# Altium project COMRAD_0v1.PrjPCB (part 5 of 5)

## Sheet DDR3_TOP_LEVEL.SchDoc
size A3; DocumentNumber: 3; SheetNumber: 3; SheetTotal: 47
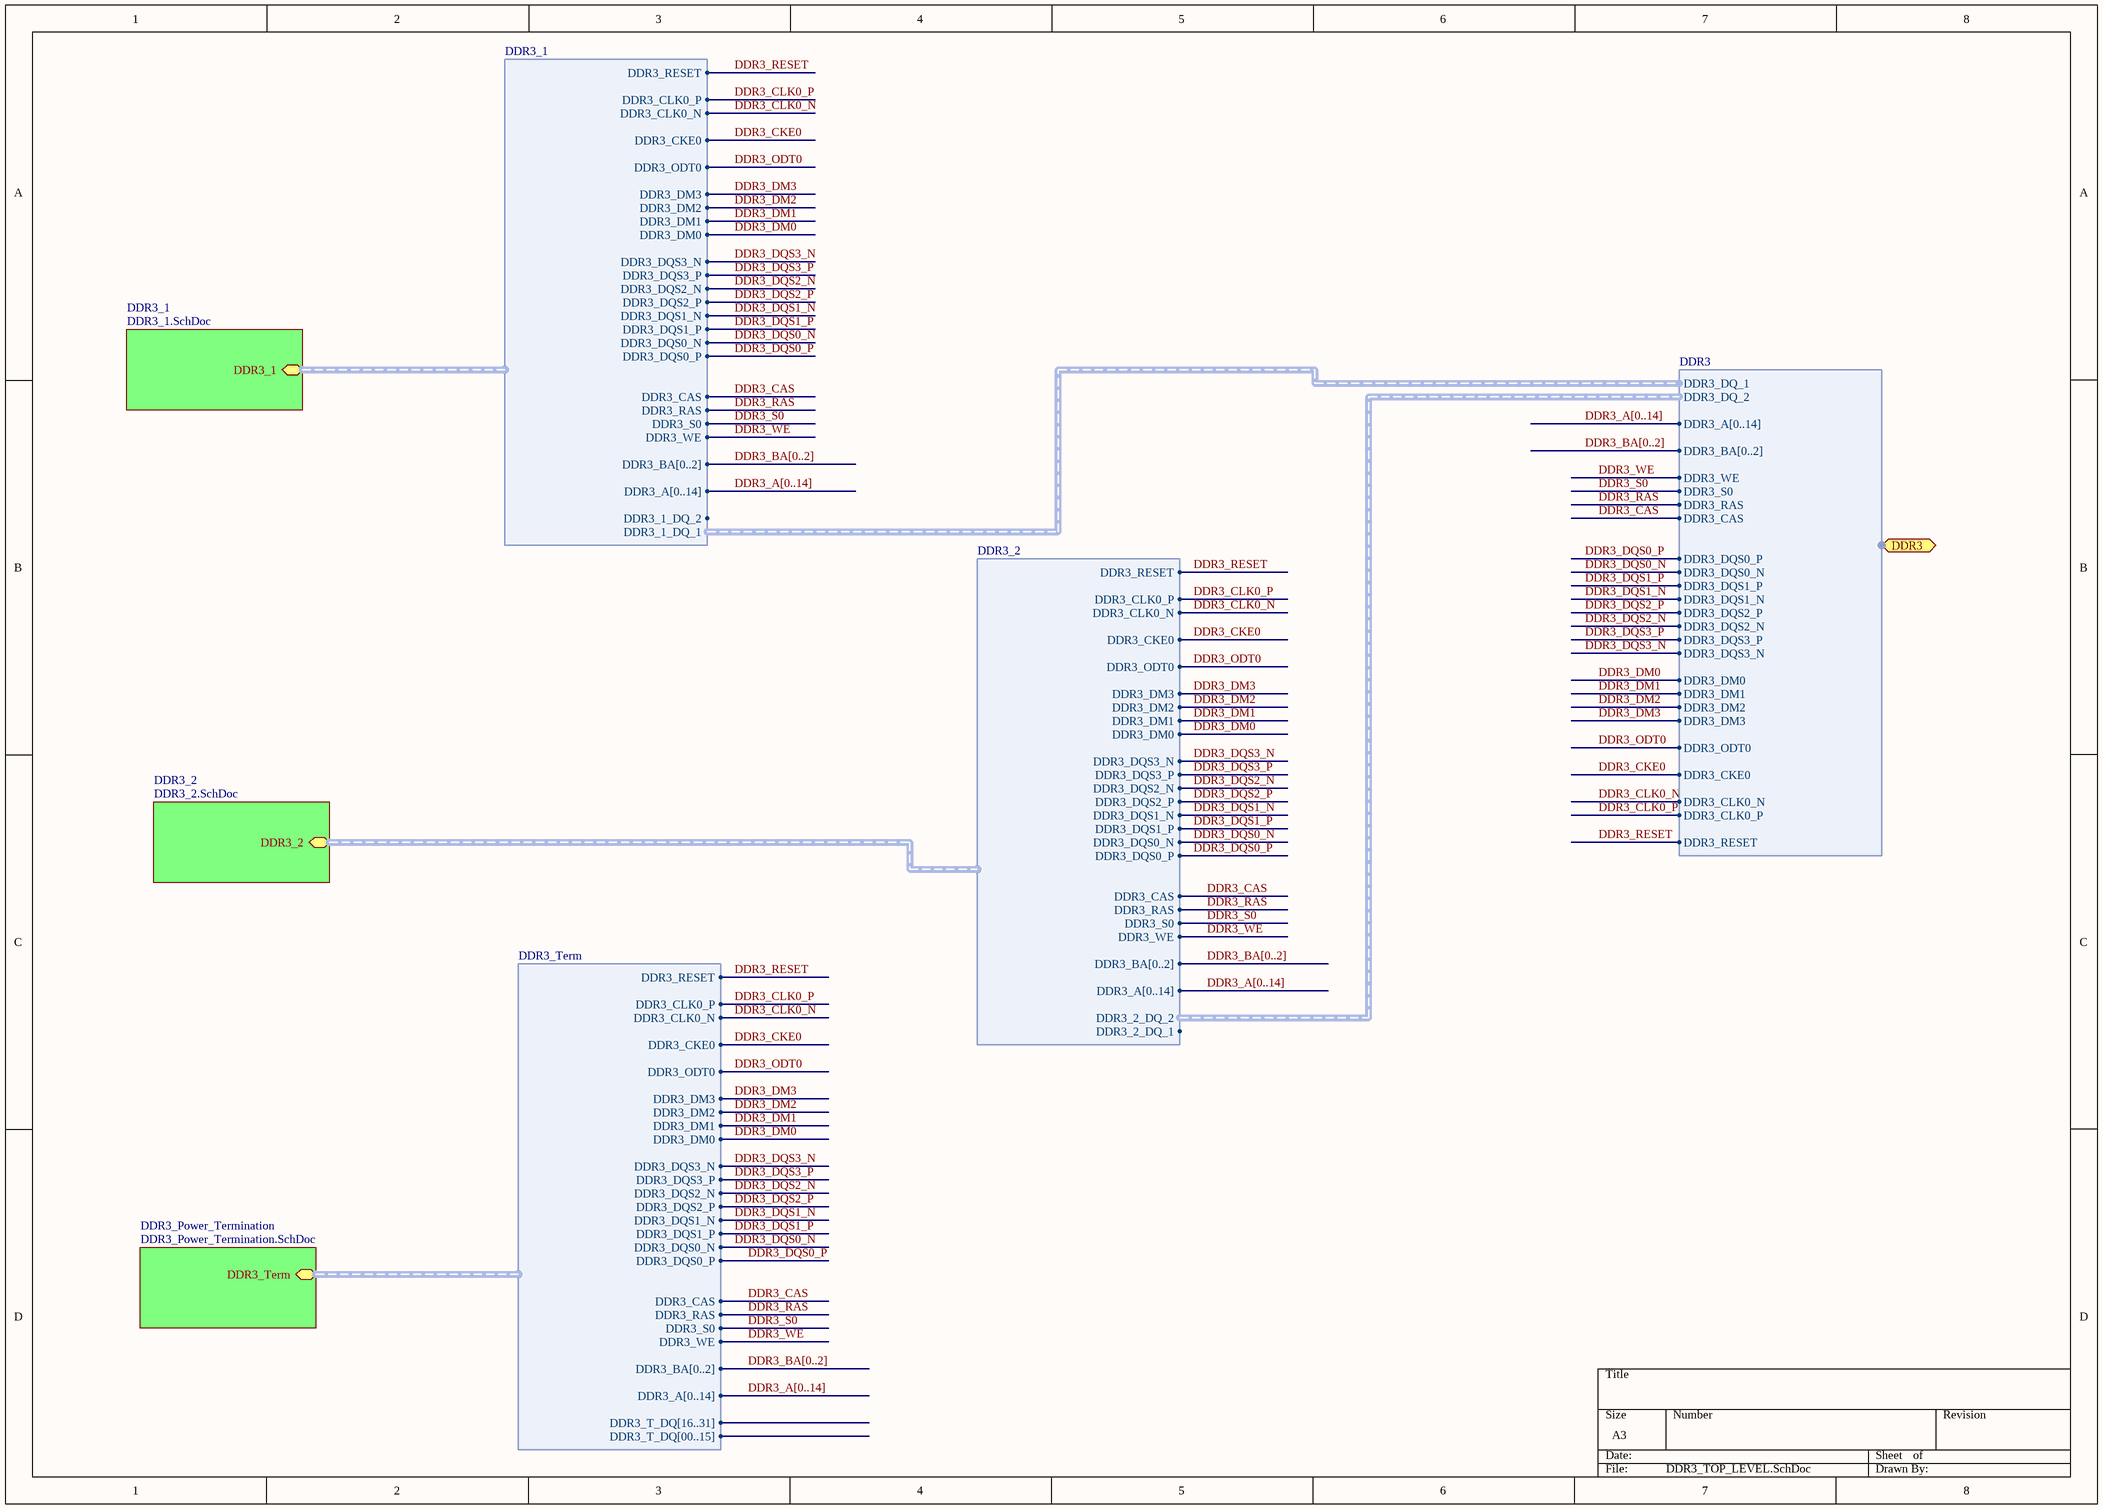
[diagram p42: DDR3_TOP_LEVEL.SchDoc]

### Sub-sheets
DDR3_1 = DDR3_1.SchDoc: DDR3_1 (harness DDR3_1)
DDR3_2 = DDR3_2.SchDoc: DDR3_2 (harness DDR3_2)
DDR3_Power_Termination = DDR3_Power_Termination.SchDoc: DDR3_Term (harness DDR3_Term)

### Ports
DDR3 (harness DDR3)

### Harnesses
DDR3: DDR3_DQ_1, DDR3_DQ_2, DDR3_A[0..14], DDR3_BA[0..2], DDR3_WE, DDR3_S0, DDR3_RAS, DDR3_CAS, DDR3_DQS0_P, DDR3_DQS0_N, DDR3_DQS1_P, DDR3_DQS1_N, DDR3_DQS2_P, DDR3_DQS2_N, DDR3_DQS3_P, DDR3_DQS3_N, DDR3_DM0, DDR3_DM1, DDR3_DM2, DDR3_DM3, DDR3_ODT0, DDR3_CKE0, DDR3_CLK0_N, DDR3_CLK0_P, DDR3_RESET
DDR3_1: DDR3_1_DQ_1, DDR3_1_DQ_2, DDR3_A[0..14], DDR3_BA[0..2], DDR3_WE, DDR3_S0, DDR3_RAS, DDR3_CAS, DDR3_DQS0_P, DDR3_DQS0_N, DDR3_DQS1_P, DDR3_DQS1_N, DDR3_DQS2_P, DDR3_DQS2_N, DDR3_DQS3_P, DDR3_DQS3_N, DDR3_DM0, DDR3_DM1, DDR3_DM2, DDR3_DM3, DDR3_ODT0, DDR3_CKE0, DDR3_CLK0_N, DDR3_CLK0_P, DDR3_RESET
DDR3_2: DDR3_2_DQ_1, DDR3_2_DQ_2, DDR3_A[0..14], DDR3_BA[0..2], DDR3_WE, DDR3_S0, DDR3_RAS, DDR3_CAS, DDR3_DQS0_P, DDR3_DQS0_N, DDR3_DQS1_P, DDR3_DQS1_N, DDR3_DQS2_P, DDR3_DQS2_N, DDR3_DQS3_P, DDR3_DQS3_N, DDR3_DM0, DDR3_DM1, DDR3_DM2, DDR3_DM3, DDR3_ODT0, DDR3_CKE0, DDR3_CLK0_N, DDR3_CLK0_P, DDR3_RESET
DDR3_Term: DDR3_T_DQ[00..15], DDR3_T_DQ[16..31], DDR3_A[0..14], DDR3_BA[0..2], DDR3_WE, DDR3_S0, DDR3_RAS, DDR3_CAS, DDR3_DQS0_P, DDR3_DQS0_N, DDR3_DQS1_P, DDR3_DQS1_N, DDR3_DQS2_P, DDR3_DQS2_N, DDR3_DQS3_P, DDR3_DQS3_N, DDR3_DM0, DDR3_DM1, DDR3_DM2, DDR3_DM3, DDR3_ODT0, DDR3_CKE0, DDR3_CLK0_N, DDR3_CLK0_P, DDR3_RESET

### Nets
DDR3_CAS: port DDR3.DDR3_CAS, sheet DDR3_1/DDR3_1.DDR3_CAS, sheet DDR3_2/DDR3_2.DDR3_CAS, sheet DDR3_Power_Termination/DDR3_Term.DDR3_CAS
DDR3_CKE0: port DDR3.DDR3_CKE0, sheet DDR3_1/DDR3_1.DDR3_CKE0, sheet DDR3_2/DDR3_2.DDR3_CKE0, sheet DDR3_Power_Termination/DDR3_Term.DDR3_CKE0
DDR3_CLK0_N: port DDR3.DDR3_CLK0_N, sheet DDR3_1/DDR3_1.DDR3_CLK0_N, sheet DDR3_2/DDR3_2.DDR3_CLK0_N, sheet DDR3_Power_Termination/DDR3_Term.DDR3_CLK0_N
DDR3_CLK0_P: port DDR3.DDR3_CLK0_P, sheet DDR3_1/DDR3_1.DDR3_CLK0_P, sheet DDR3_2/DDR3_2.DDR3_CLK0_P, sheet DDR3_Power_Termination/DDR3_Term.DDR3_CLK0_P
DDR3_DM0: port DDR3.DDR3_DM0, sheet DDR3_1/DDR3_1.DDR3_DM0, sheet DDR3_2/DDR3_2.DDR3_DM0, sheet DDR3_Power_Termination/DDR3_Term.DDR3_DM0
DDR3_DM1: port DDR3.DDR3_DM1, sheet DDR3_1/DDR3_1.DDR3_DM1, sheet DDR3_2/DDR3_2.DDR3_DM1, sheet DDR3_Power_Termination/DDR3_Term.DDR3_DM1
DDR3_DM2: port DDR3.DDR3_DM2, sheet DDR3_1/DDR3_1.DDR3_DM2, sheet DDR3_2/DDR3_2.DDR3_DM2, sheet DDR3_Power_Termination/DDR3_Term.DDR3_DM2
DDR3_DM3: port DDR3.DDR3_DM3, sheet DDR3_1/DDR3_1.DDR3_DM3, sheet DDR3_2/DDR3_2.DDR3_DM3, sheet DDR3_Power_Termination/DDR3_Term.DDR3_DM3
DDR3_DQS0_N: port DDR3.DDR3_DQS0_N, sheet DDR3_1/DDR3_1.DDR3_DQS0_N, sheet DDR3_2/DDR3_2.DDR3_DQS0_N, sheet DDR3_Power_Termination/DDR3_Term.DDR3_DQS0_N
DDR3_DQS0_P: port DDR3.DDR3_DQS0_P, sheet DDR3_1/DDR3_1.DDR3_DQS0_P, sheet DDR3_2/DDR3_2.DDR3_DQS0_P, sheet DDR3_Power_Termination/DDR3_Term.DDR3_DQS0_P
DDR3_DQS1_N: port DDR3.DDR3_DQS1_N, sheet DDR3_1/DDR3_1.DDR3_DQS1_N, sheet DDR3_2/DDR3_2.DDR3_DQS1_N, sheet DDR3_Power_Termination/DDR3_Term.DDR3_DQS1_N
DDR3_DQS1_P: port DDR3.DDR3_DQS1_P, sheet DDR3_1/DDR3_1.DDR3_DQS1_P, sheet DDR3_2/DDR3_2.DDR3_DQS1_P, sheet DDR3_Power_Termination/DDR3_Term.DDR3_DQS1_P
DDR3_DQS2_N: port DDR3.DDR3_DQS2_N, sheet DDR3_1/DDR3_1.DDR3_DQS2_N, sheet DDR3_2/DDR3_2.DDR3_DQS2_N, sheet DDR3_Power_Termination/DDR3_Term.DDR3_DQS2_N
DDR3_DQS2_P: port DDR3.DDR3_DQS2_P, sheet DDR3_1/DDR3_1.DDR3_DQS2_P, sheet DDR3_2/DDR3_2.DDR3_DQS2_P, sheet DDR3_Power_Termination/DDR3_Term.DDR3_DQS2_P
DDR3_DQS3_N: port DDR3.DDR3_DQS3_N, sheet DDR3_1/DDR3_1.DDR3_DQS3_N, sheet DDR3_2/DDR3_2.DDR3_DQS3_N, sheet DDR3_Power_Termination/DDR3_Term.DDR3_DQS3_N
DDR3_DQS3_P: port DDR3.DDR3_DQS3_P, sheet DDR3_1/DDR3_1.DDR3_DQS3_P, sheet DDR3_2/DDR3_2.DDR3_DQS3_P, sheet DDR3_Power_Termination/DDR3_Term.DDR3_DQS3_P
DDR3_ODT0: port DDR3.DDR3_ODT0, sheet DDR3_1/DDR3_1.DDR3_ODT0, sheet DDR3_2/DDR3_2.DDR3_ODT0, sheet DDR3_Power_Termination/DDR3_Term.DDR3_ODT0
DDR3_RAS: port DDR3.DDR3_RAS, sheet DDR3_1/DDR3_1.DDR3_RAS, sheet DDR3_2/DDR3_2.DDR3_RAS, sheet DDR3_Power_Termination/DDR3_Term.DDR3_RAS
DDR3_RESET: port DDR3.DDR3_RESET, sheet DDR3_1/DDR3_1.DDR3_RESET, sheet DDR3_2/DDR3_2.DDR3_RESET, sheet DDR3_Power_Termination/DDR3_Term.DDR3_RESET
DDR3_S0: port DDR3.DDR3_S0, sheet DDR3_1/DDR3_1.DDR3_S0, sheet DDR3_2/DDR3_2.DDR3_S0, sheet DDR3_Power_Termination/DDR3_Term.DDR3_S0
DDR3_WE: port DDR3.DDR3_WE, sheet DDR3_1/DDR3_1.DDR3_WE, sheet DDR3_2/DDR3_2.DDR3_WE, sheet DDR3_Power_Termination/DDR3_Term.DDR3_WE

### Buses and harness runs
bus DDR3_A[0..14]
bus DDR3_BA[0..2]

## Sheet DDR3_1.SchDoc
size A4; DocumentNumber: 13; SheetNumber: 13; SheetTotal: 47
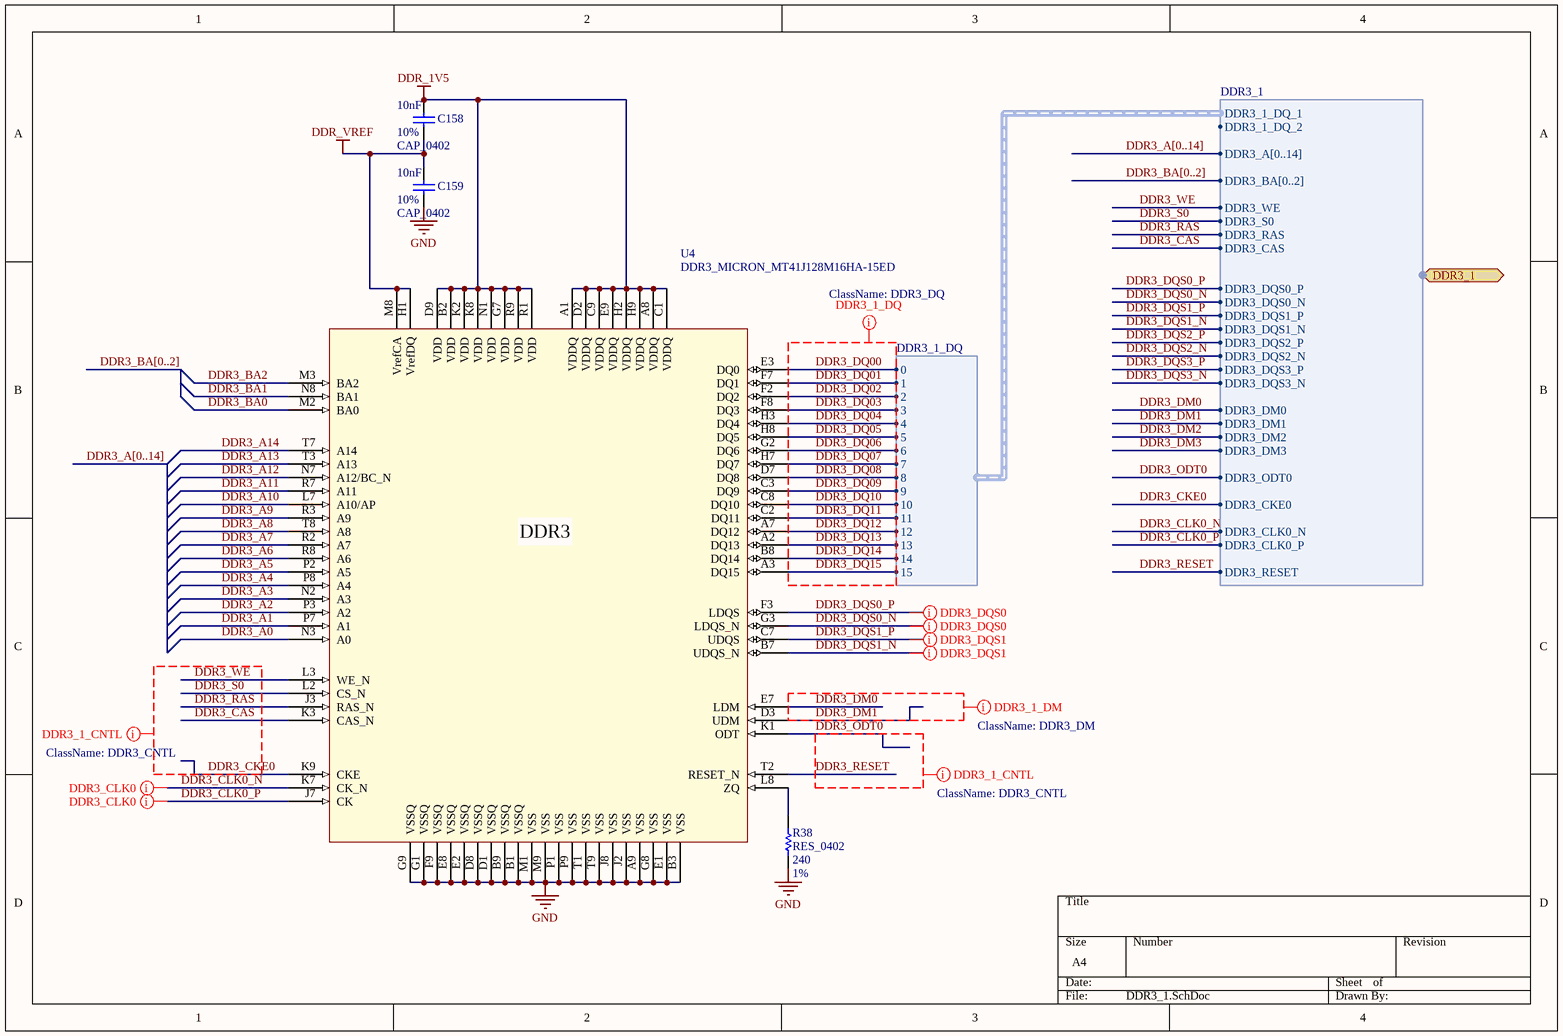
[diagram p43: DDR3_1.SchDoc]

### Parts
C158  CAP_0402  value 10nF  Tolerance: 10%  [CAPC0402(1005)60_N]
C159  CAP_0402  value 10nF  Tolerance: 10%  [CAPC0402(1005)60_N]
R38  RES_0402  value 240  Tolerance: 1%  [RESC0402(1005)_N]
U4  DDR3_MICRON_MT41J128M16HA-15ED  [DDR3_MICRON_MT41J128M16HA-15ED_FBGA96]

### Ports
DDR3_1 (harness DDR3_1)

### Harnesses
DDR3_1: DDR3_1_DQ_1, DDR3_1_DQ_2, DDR3_A[0..14], DDR3_BA[0..2], DDR3_WE, DDR3_S0, DDR3_RAS, DDR3_CAS, DDR3_DQS0_P, DDR3_DQS0_N, DDR3_DQS1_P, DDR3_DQS1_N, DDR3_DQS2_P, DDR3_DQS2_N, DDR3_DQS3_P, DDR3_DQS3_N, DDR3_DM0, DDR3_DM1, DDR3_DM2, DDR3_DM3, DDR3_ODT0, DDR3_CKE0, DDR3_CLK0_N, DDR3_CLK0_P, DDR3_RESET
DDR3_1_DQ: 0, 1, 2, 3, 4, 5, 6, 7, 8, 9, 10, 11, 12, 13, 14, 15

### Nets
DDR_1V5: C158.2 U4.A1(VDDQ) U4.A8(VDDQ) U4.B2(VDD) U4.C1(VDDQ) U4.C9(VDDQ) U4.D2(VDDQ) U4.D9(VDD) U4.E9(VDDQ) U4.G7(VDD) U4.H2(VDDQ) U4.H9(VDDQ) U4.K2(VDD) U4.K8(VDD) U4.N1(VDD) U4.R1(VDD) U4.R9(VDD)
DDR_VREF: C158.1 C159.2 U4.H1(VrefDQ) U4.M8(VrefCA)
GND: C159.1 R38.1 U4.A9(VSS) U4.B1(VSSQ) U4.B3(VSS) U4.B9(VSSQ) U4.D1(VSSQ) U4.D8(VSSQ) U4.E1(VSS) U4.E2(VSSQ) U4.E8(VSSQ) U4.F9(VSSQ) U4.G1(VSSQ) U4.G8(VSS) U4.G9(VSSQ) U4.J2(VSS) U4.J8(VSS) U4.M1(VSS) U4.M9(VSS) U4.P1(VSS) U4.P9(VSS) U4.T1(VSS) U4.T9(VSS)
DDR3_A0: U4.N3(A0)
DDR3_A1: U4.P7(A1)
DDR3_A2: U4.P3(A2)
DDR3_A3: U4.N2(A3)
DDR3_A4: U4.P8(A4)
DDR3_A5: U4.P2(A5)
DDR3_A6: U4.R8(A6)
DDR3_A7: U4.R2(A7)
DDR3_A8: U4.T8(A8)
DDR3_A9: U4.R3(A9)
DDR3_A10: U4.L7(A10/AP)
DDR3_A11: U4.R7(A11)
DDR3_A12: U4.N7(A12/BC_N)
DDR3_A13: U4.T3(A13)
DDR3_A14: U4.T7(A14)
DDR3_BA0: U4.M2(BA0)
DDR3_BA1: U4.N8(BA1)
DDR3_BA2: U4.M3(BA2)
DDR3_CAS: U4.K3(CAS_N) ; port DDR3_1.DDR3_CAS
DDR3_CKE0: U4.K9(CKE) ; port DDR3_1.DDR3_CKE0
DDR3_CLK0_N: U4.K7(CK_N) ; port DDR3_1.DDR3_CLK0_N
DDR3_CLK0_P: U4.J7(CK) ; port DDR3_1.DDR3_CLK0_P
DDR3_DM0: U4.E7(LDM) ; port DDR3_1.DDR3_DM0
DDR3_DM1: U4.D3(UDM) ; port DDR3_1.DDR3_DM1
DDR3_DQ00: U4.E3(DQ0) ; harness DDR3_1_DQ.0
DDR3_DQ01: U4.F7(DQ1) ; harness DDR3_1_DQ.1
DDR3_DQ02: U4.F2(DQ2) ; harness DDR3_1_DQ.2
DDR3_DQ03: U4.F8(DQ3) ; harness DDR3_1_DQ.3
DDR3_DQ04: U4.H3(DQ4) ; harness DDR3_1_DQ.4
DDR3_DQ05: U4.H8(DQ5) ; harness DDR3_1_DQ.5
DDR3_DQ06: U4.G2(DQ6) ; harness DDR3_1_DQ.6
DDR3_DQ07: U4.H7(DQ7) ; harness DDR3_1_DQ.7
DDR3_DQ08: U4.D7(DQ8) ; harness DDR3_1_DQ.8
DDR3_DQ09: U4.C3(DQ9) ; harness DDR3_1_DQ.9
DDR3_DQ10: U4.C8(DQ10) ; harness DDR3_1_DQ.10
DDR3_DQ11: U4.C2(DQ11) ; harness DDR3_1_DQ.11
DDR3_DQ12: U4.A7(DQ12) ; harness DDR3_1_DQ.12
DDR3_DQ13: U4.A2(DQ13) ; harness DDR3_1_DQ.13
DDR3_DQ14: U4.B8(DQ14) ; harness DDR3_1_DQ.14
DDR3_DQ15: U4.A3(DQ15) ; harness DDR3_1_DQ.15
DDR3_DQS0_N: U4.G3(LDQS_N) ; port DDR3_1.DDR3_DQS0_N
DDR3_DQS0_P: U4.F3(LDQS) ; port DDR3_1.DDR3_DQS0_P
DDR3_DQS1_N: U4.B7(UDQS_N) ; port DDR3_1.DDR3_DQS1_N
DDR3_DQS1_P: U4.C7(UDQS) ; port DDR3_1.DDR3_DQS1_P
DDR3_ODT0: U4.K1(ODT) ; port DDR3_1.DDR3_ODT0
DDR3_RAS: U4.J3(RAS_N) ; port DDR3_1.DDR3_RAS
DDR3_RESET: U4.T2(RESET_N) ; port DDR3_1.DDR3_RESET
DDR3_S0: U4.L2(CS_N) ; port DDR3_1.DDR3_S0
DDR3_WE: U4.L3(WE_N) ; port DDR3_1.DDR3_WE
NetR38_2: R38.2 U4.L8(ZQ)

### Buses and harness runs
bus DDR3_A[0..14]
bus DDR3_BA[0..2]

### Layout directives
differential pair: DDR3_CLK0_N, DDR3_CLK0_P, DDR3_DQS0_N, DDR3_DQS0_P, DDR3_DQS1_N, DDR3_DQS1_P
net class DDR3_DQ: DDR3_DQ00, DDR3_DQ01, DDR3_DQ02, DDR3_DQ03, DDR3_DQ04, DDR3_DQ05, DDR3_DQ06, DDR3_DQ07, DDR3_DQ08, DDR3_DQ09, DDR3_DQ10, DDR3_DQ11, DDR3_DQ12, DDR3_DQ13, DDR3_DQ14, DDR3_DQ15
net class DDR3_DM: DDR3_DM0, DDR3_DM1
net class DDR3_CNTL: DDR3_CAS, DDR3_CKE0, DDR3_ODT0, DDR3_RAS, DDR3_RESET, DDR3_S0, DDR3_WE

### Notes on the sheet
- (in symbol MT41J128M16HA-15E:D TR) DDR3

### Library data of the parts
C158 C159 = CAP_0402: 10000pF, ceramic, 10% 6.3V X5R, 0402; Part Number: GRM155R60J103KA01D; Manufacturer: Murata Electronics North America; Footprint Ref: CAPC0402(1005)60_N; Library Ref: CAP_0402
R38 = RES_0402: 240 ohm, 1% 1/16W, 0402; Part Number: CRCW0402240RFKED; Manufacturer: Vishay/Dale; Library Ref: RES_0402; Footprint Ref: RESC0402(1005)_N
U4 = MT41J128M16HA-15E:D TR: MT41J128M16HA-15E:D, DDR3 SDRAM 4Gb x4, x8, x16, FBGA96; Manufacturer: MICRON; Part Number: MT41J128M16HA-15E:D TR

## Sheet DDR3_2.SchDoc
size A4; DocumentNumber: 14; SheetNumber: 14; SheetTotal: 47
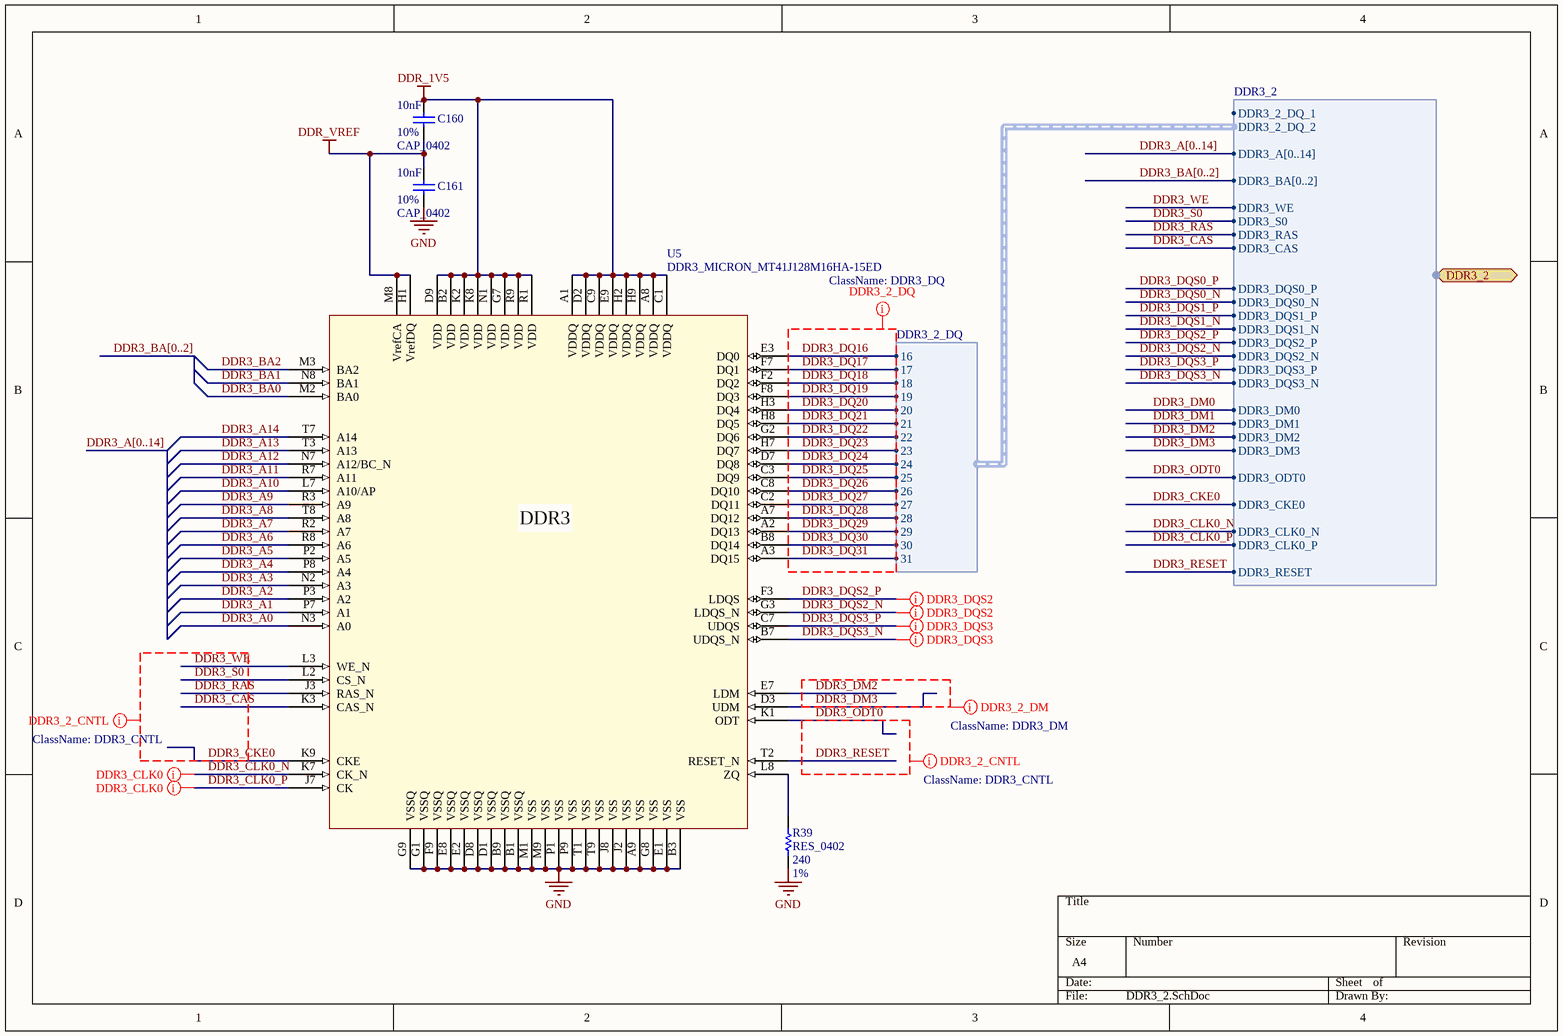
[diagram p44: DDR3_2.SchDoc]

### Parts
C160  CAP_0402  value 10nF  Tolerance: 10%  [CAPC0402(1005)60_N]
C161  CAP_0402  value 10nF  Tolerance: 10%  [CAPC0402(1005)60_N]
R39  RES_0402  value 240  Tolerance: 1%  [RESC0402(1005)_N]
U5  DDR3_MICRON_MT41J128M16HA-15ED  [DDR3_MICRON_MT41J128M16HA-15ED_FBGA96]

### Ports
DDR3_2 (harness DDR3_2)

### Harnesses
DDR3_2: DDR3_2_DQ_1, DDR3_2_DQ_2, DDR3_A[0..14], DDR3_BA[0..2], DDR3_WE, DDR3_S0, DDR3_RAS, DDR3_CAS, DDR3_DQS0_P, DDR3_DQS0_N, DDR3_DQS1_P, DDR3_DQS1_N, DDR3_DQS2_P, DDR3_DQS2_N, DDR3_DQS3_P, DDR3_DQS3_N, DDR3_DM0, DDR3_DM1, DDR3_DM2, DDR3_DM3, DDR3_ODT0, DDR3_CKE0, DDR3_CLK0_N, DDR3_CLK0_P, DDR3_RESET
DDR3_2_DQ: 16, 17, 18, 19, 20, 21, 22, 23, 24, 25, 26, 27, 28, 29, 30, 31

### Nets
DDR_1V5: C160.2 U5.A1(VDDQ) U5.A8(VDDQ) U5.B2(VDD) U5.C1(VDDQ) U5.C9(VDDQ) U5.D2(VDDQ) U5.D9(VDD) U5.E9(VDDQ) U5.G7(VDD) U5.H2(VDDQ) U5.H9(VDDQ) U5.K2(VDD) U5.K8(VDD) U5.N1(VDD) U5.R1(VDD) U5.R9(VDD)
DDR_VREF: C160.1 C161.2 U5.H1(VrefDQ) U5.M8(VrefCA)
GND: C161.1 R39.1 U5.A9(VSS) U5.B1(VSSQ) U5.B3(VSS) U5.B9(VSSQ) U5.D1(VSSQ) U5.D8(VSSQ) U5.E1(VSS) U5.E2(VSSQ) U5.E8(VSSQ) U5.F9(VSSQ) U5.G1(VSSQ) U5.G8(VSS) U5.G9(VSSQ) U5.J2(VSS) U5.J8(VSS) U5.M1(VSS) U5.M9(VSS) U5.P1(VSS) U5.P9(VSS) U5.T1(VSS) U5.T9(VSS)
DDR3_A0: U5.N3(A0)
DDR3_A1: U5.P7(A1)
DDR3_A2: U5.P3(A2)
DDR3_A3: U5.N2(A3)
DDR3_A4: U5.P8(A4)
DDR3_A5: U5.P2(A5)
DDR3_A6: U5.R8(A6)
DDR3_A7: U5.R2(A7)
DDR3_A8: U5.T8(A8)
DDR3_A9: U5.R3(A9)
DDR3_A10: U5.L7(A10/AP)
DDR3_A11: U5.R7(A11)
DDR3_A12: U5.N7(A12/BC_N)
DDR3_A13: U5.T3(A13)
DDR3_A14: U5.T7(A14)
DDR3_BA0: U5.M2(BA0)
DDR3_BA1: U5.N8(BA1)
DDR3_BA2: U5.M3(BA2)
DDR3_CAS: U5.K3(CAS_N) ; port DDR3_2.DDR3_CAS
DDR3_CKE0: U5.K9(CKE) ; port DDR3_2.DDR3_CKE0
DDR3_CLK0_N: U5.K7(CK_N) ; port DDR3_2.DDR3_CLK0_N
DDR3_CLK0_P: U5.J7(CK) ; port DDR3_2.DDR3_CLK0_P
DDR3_DM2: U5.E7(LDM) ; port DDR3_2.DDR3_DM2
DDR3_DM3: U5.D3(UDM) ; port DDR3_2.DDR3_DM3
DDR3_DQ16: U5.E3(DQ0) ; harness DDR3_2_DQ.16
DDR3_DQ17: U5.F7(DQ1) ; harness DDR3_2_DQ.17
DDR3_DQ18: U5.F2(DQ2) ; harness DDR3_2_DQ.18
DDR3_DQ19: U5.F8(DQ3) ; harness DDR3_2_DQ.19
DDR3_DQ20: U5.H3(DQ4) ; harness DDR3_2_DQ.20
DDR3_DQ21: U5.H8(DQ5) ; harness DDR3_2_DQ.21
DDR3_DQ22: U5.G2(DQ6) ; harness DDR3_2_DQ.22
DDR3_DQ23: U5.H7(DQ7) ; harness DDR3_2_DQ.23
DDR3_DQ24: U5.D7(DQ8) ; harness DDR3_2_DQ.24
DDR3_DQ25: U5.C3(DQ9) ; harness DDR3_2_DQ.25
DDR3_DQ26: U5.C8(DQ10) ; harness DDR3_2_DQ.26
DDR3_DQ27: U5.C2(DQ11) ; harness DDR3_2_DQ.27
DDR3_DQ28: U5.A7(DQ12) ; harness DDR3_2_DQ.28
DDR3_DQ29: U5.A2(DQ13) ; harness DDR3_2_DQ.29
DDR3_DQ30: U5.B8(DQ14) ; harness DDR3_2_DQ.30
DDR3_DQ31: U5.A3(DQ15) ; harness DDR3_2_DQ.31
DDR3_DQS2_N: U5.G3(LDQS_N) ; port DDR3_2.DDR3_DQS2_N
DDR3_DQS2_P: U5.F3(LDQS) ; port DDR3_2.DDR3_DQS2_P
DDR3_DQS3_N: U5.B7(UDQS_N) ; port DDR3_2.DDR3_DQS3_N
DDR3_DQS3_P: U5.C7(UDQS) ; port DDR3_2.DDR3_DQS3_P
DDR3_ODT0: U5.K1(ODT) ; port DDR3_2.DDR3_ODT0
DDR3_RAS: U5.J3(RAS_N) ; port DDR3_2.DDR3_RAS
DDR3_RESET: U5.T2(RESET_N) ; port DDR3_2.DDR3_RESET
DDR3_S0: U5.L2(CS_N) ; port DDR3_2.DDR3_S0
DDR3_WE: U5.L3(WE_N) ; port DDR3_2.DDR3_WE
NetR39_2: R39.2 U5.L8(ZQ)

### Buses and harness runs
bus DDR3_A[0..14]
bus DDR3_BA[0..2]

### Layout directives
differential pair: DDR3_CLK0_N, DDR3_CLK0_P, DDR3_DQS2_N, DDR3_DQS2_P, DDR3_DQS3_N, DDR3_DQS3_P
net class DDR3_DQ: DDR3_DQ16, DDR3_DQ17, DDR3_DQ18, DDR3_DQ19, DDR3_DQ20, DDR3_DQ21, DDR3_DQ22, DDR3_DQ23, DDR3_DQ24, DDR3_DQ25, DDR3_DQ26, DDR3_DQ27, DDR3_DQ28, DDR3_DQ29, DDR3_DQ30, DDR3_DQ31
net class DDR3_DM: DDR3_DM2, DDR3_DM3
net class DDR3_CNTL: DDR3_CAS, DDR3_CKE0, DDR3_ODT0, DDR3_RAS, DDR3_RESET, DDR3_S0, DDR3_WE

### Notes on the sheet
- (in symbol MT41J128M16HA-15E:D TR) DDR3

### Library data of the parts
C160 C161 = CAP_0402: as C158 on sheet DDR3_1; Footprint Ref: CAPC0402(1005)60_N; Library Ref: CAP_0402
R39 = RES_0402: as R38 on sheet DDR3_1; Library Ref: RES_0402; Footprint Ref: RESC0402(1005)_N
U5 = MT41J128M16HA-15E:D TR: as U4 on sheet DDR3_1; Part Number: MT41J128M16HA-15E:D TR

## Sheet DDR3_Power_Termination.SchDoc
size A3; DocumentNumber: 15; SheetNumber: 15; SheetTotal: 47
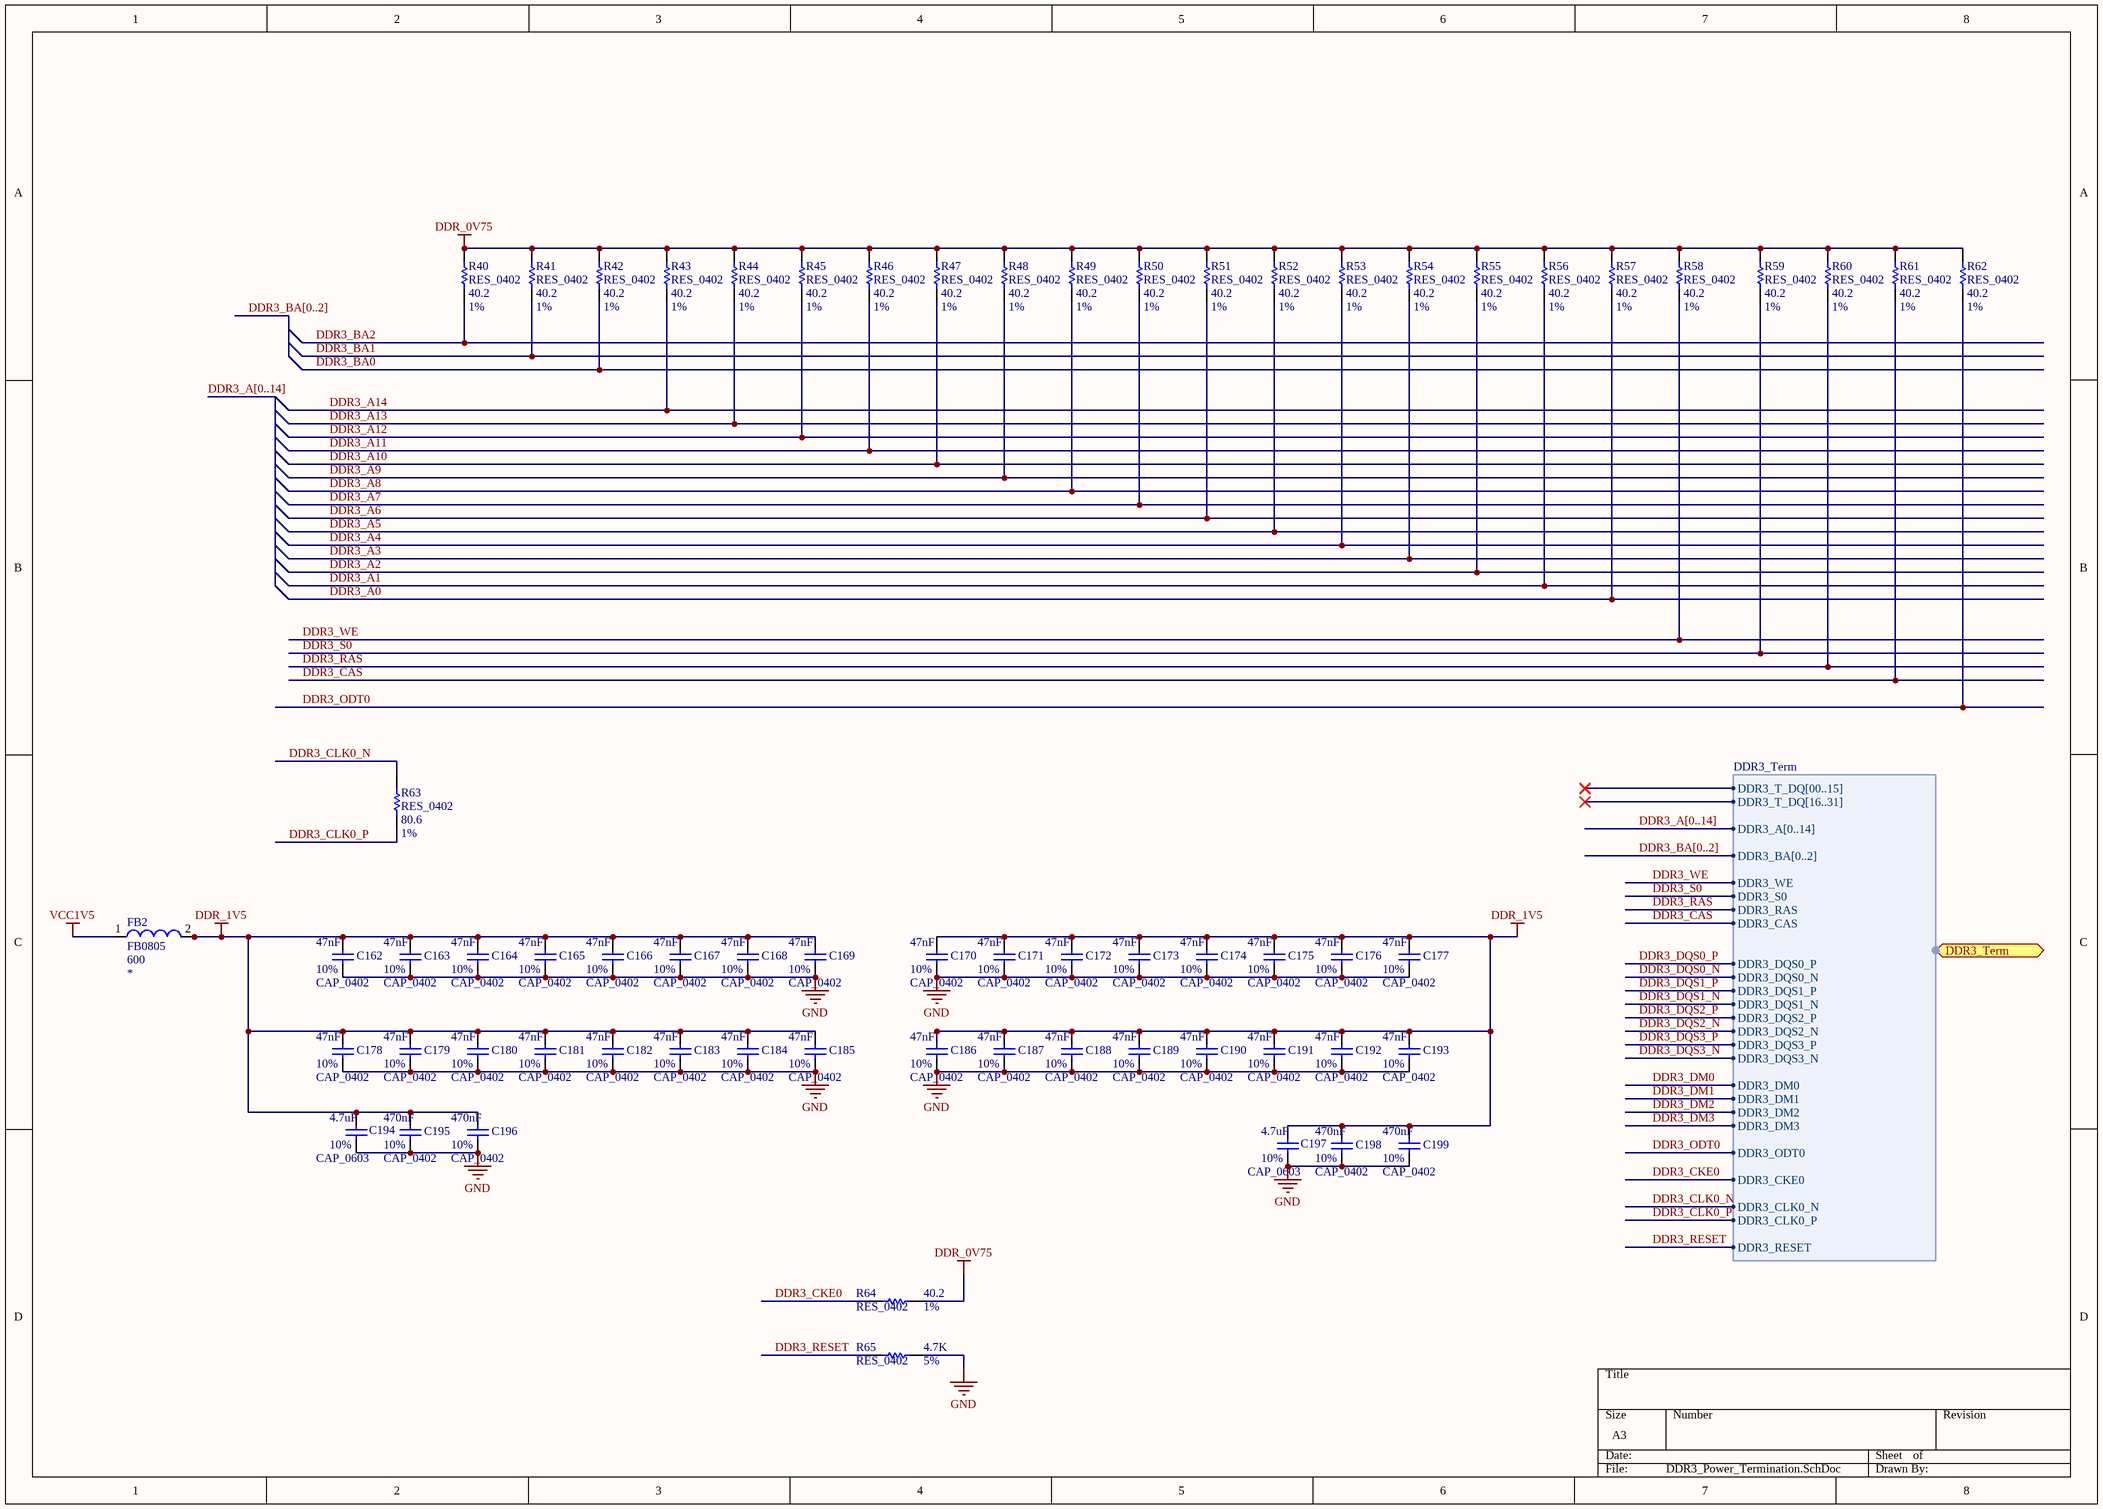
[diagram p45: DDR3_Power_Termination.SchDoc]

### Parts
C162  CAP_0402  value 47nF  Tolerance: 10%  [CAPC0402(1005)60_N]
C163  CAP_0402  value 47nF  Tolerance: 10%  [CAPC0402(1005)60_N]
C164  CAP_0402  value 47nF  Tolerance: 10%  [CAPC0402(1005)60_N]
C165  CAP_0402  value 47nF  Tolerance: 10%  [CAPC0402(1005)60_N]
C166  CAP_0402  value 47nF  Tolerance: 10%  [CAPC0402(1005)60_N]
C167  CAP_0402  value 47nF  Tolerance: 10%  [CAPC0402(1005)60_N]
C168  CAP_0402  value 47nF  Tolerance: 10%  [CAPC0402(1005)60_N]
C169  CAP_0402  value 47nF  Tolerance: 10%  [CAPC0402(1005)60_N]
C170  CAP_0402  value 47nF  Tolerance: 10%  [CAPC0402(1005)60_N]
C171  CAP_0402  value 47nF  Tolerance: 10%  [CAPC0402(1005)60_N]
C172  CAP_0402  value 47nF  Tolerance: 10%  [CAPC0402(1005)60_N]
C173  CAP_0402  value 47nF  Tolerance: 10%  [CAPC0402(1005)60_N]
C174  CAP_0402  value 47nF  Tolerance: 10%  [CAPC0402(1005)60_N]
C175  CAP_0402  value 47nF  Tolerance: 10%  [CAPC0402(1005)60_N]
C176  CAP_0402  value 47nF  Tolerance: 10%  [CAPC0402(1005)60_N]
C177  CAP_0402  value 47nF  Tolerance: 10%  [CAPC0402(1005)60_N]
C178  CAP_0402  value 47nF  Tolerance: 10%  [CAPC0402(1005)60_N]
C179  CAP_0402  value 47nF  Tolerance: 10%  [CAPC0402(1005)60_N]
C180  CAP_0402  value 47nF  Tolerance: 10%  [CAPC0402(1005)60_N]
C181  CAP_0402  value 47nF  Tolerance: 10%  [CAPC0402(1005)60_N]
C182  CAP_0402  value 47nF  Tolerance: 10%  [CAPC0402(1005)60_N]
C183  CAP_0402  value 47nF  Tolerance: 10%  [CAPC0402(1005)60_N]
C184  CAP_0402  value 47nF  Tolerance: 10%  [CAPC0402(1005)60_N]
C185  CAP_0402  value 47nF  Tolerance: 10%  [CAPC0402(1005)60_N]
C186  CAP_0402  value 47nF  Tolerance: 10%  [CAPC0402(1005)60_N]
C187  CAP_0402  value 47nF  Tolerance: 10%  [CAPC0402(1005)60_N]
C188  CAP_0402  value 47nF  Tolerance: 10%  [CAPC0402(1005)60_N]
C189  CAP_0402  value 47nF  Tolerance: 10%  [CAPC0402(1005)60_N]
C190  CAP_0402  value 47nF  Tolerance: 10%  [CAPC0402(1005)60_N]
C191  CAP_0402  value 47nF  Tolerance: 10%  [CAPC0402(1005)60_N]
C192  CAP_0402  value 47nF  Tolerance: 10%  [CAPC0402(1005)60_N]
C193  CAP_0402  value 47nF  Tolerance: 10%  [CAPC0402(1005)60_N]
C194  CAP_0603  value 4.7uF  Tolerance: 10%  [CAPC0603(1608)100_N]
C195  CAP_0402  value 470nF  Tolerance: 10%  [CAPC0402(1005)60_N]
C196  CAP_0402  value 470nF  Tolerance: 10%  [CAPC0402(1005)60_N]
C197  CAP_0603  value 4.7uF  Tolerance: 10%  [CAPC0603(1608)100_N]
C198  CAP_0402  value 470nF  Tolerance: 10%  [CAPC0402(1005)60_N]
C199  CAP_0402  value 470nF  Tolerance: 10%  [CAPC0402(1005)60_N]
FB2  FB0805  Resistance: 600  [Inductor0805(2012)]
R40  RES_0402  value 40.2  Tolerance: 1%  [RESC0402(1005)_N]
R41  RES_0402  value 40.2  Tolerance: 1%  [RESC0402(1005)_N]
R42  RES_0402  value 40.2  Tolerance: 1%  [RESC0402(1005)_N]
R43  RES_0402  value 40.2  Tolerance: 1%  [RESC0402(1005)_N]
R44  RES_0402  value 40.2  Tolerance: 1%  [RESC0402(1005)_N]
R45  RES_0402  value 40.2  Tolerance: 1%  [RESC0402(1005)_N]
R46  RES_0402  value 40.2  Tolerance: 1%  [RESC0402(1005)_N]
R47  RES_0402  value 40.2  Tolerance: 1%  [RESC0402(1005)_N]
R48  RES_0402  value 40.2  Tolerance: 1%  [RESC0402(1005)_N]
R49  RES_0402  value 40.2  Tolerance: 1%  [RESC0402(1005)_N]
R50  RES_0402  value 40.2  Tolerance: 1%  [RESC0402(1005)_N]
R51  RES_0402  value 40.2  Tolerance: 1%  [RESC0402(1005)_N]
R52  RES_0402  value 40.2  Tolerance: 1%  [RESC0402(1005)_N]
R53  RES_0402  value 40.2  Tolerance: 1%  [RESC0402(1005)_N]
R54  RES_0402  value 40.2  Tolerance: 1%  [RESC0402(1005)_N]
R55  RES_0402  value 40.2  Tolerance: 1%  [RESC0402(1005)_N]
R56  RES_0402  value 40.2  Tolerance: 1%  [RESC0402(1005)_N]
R57  RES_0402  value 40.2  Tolerance: 1%  [RESC0402(1005)_N]
R58  RES_0402  value 40.2  Tolerance: 1%  [RESC0402(1005)_N]
R59  RES_0402  value 40.2  Tolerance: 1%  [RESC0402(1005)_N]
R60  RES_0402  value 40.2  Tolerance: 1%  [RESC0402(1005)_N]
R61  RES_0402  value 40.2  Tolerance: 1%  [RESC0402(1005)_N]
R62  RES_0402  value 40.2  Tolerance: 1%  [RESC0402(1005)_N]
R63  RES_0402  value 80.6  Tolerance: 1%  [RESC0402(1005)_N]
R64  RES_0402  value 40.2  Tolerance: 1%  [RESC0402(1005)_N]
R65  RES_0402  value 4.7K  Tolerance: 5%  [RESC0402(1005)_N]

### Ports
DDR3_Term (harness DDR3_Term)

### Harnesses
DDR3_Term: DDR3_T_DQ[00..15], DDR3_T_DQ[16..31], DDR3_A[0..14], DDR3_BA[0..2], DDR3_WE, DDR3_S0, DDR3_RAS, DDR3_CAS, DDR3_DQS0_P, DDR3_DQS0_N, DDR3_DQS1_P, DDR3_DQS1_N, DDR3_DQS2_P, DDR3_DQS2_N, DDR3_DQS3_P, DDR3_DQS3_N, DDR3_DM0, DDR3_DM1, DDR3_DM2, DDR3_DM3, DDR3_ODT0, DDR3_CKE0, DDR3_CLK0_N, DDR3_CLK0_P, DDR3_RESET

### Nets
DDR_0V75: R40.2 R41.2 R42.2 R43.2 R44.2 R45.2 R46.2 R47.2 R48.2 R49.2 R50.2 R51.2 R52.2 R53.2 R54.2 R55.2 R56.2 R57.2 R58.2 R59.2 R60.2 R61.2 R62.2 R64.2
DDR_1V5: C162.2 C163.2 C164.2 C165.2 C166.2 C167.2 C168.2 C169.2 C170.2 C171.2 C172.2 C173.2 C174.2 C175.2 C176.2 C177.2 C178.2 C179.2 C180.2 C181.2 C182.2 C183.2 C184.2 C185.2 C186.2 C187.2 C188.2 C189.2 C190.2 C191.2 C192.2 C193.2 C194.2 C195.2 C196.2 C197.2 C198.2 C199.2 FB2.2
GND: C162.1 C163.1 C164.1 C165.1 C166.1 C167.1 C168.1 C169.1 C170.1 C171.1 C172.1 C173.1 C174.1 C175.1 C176.1 C177.1 C178.1 C179.1 C180.1 C181.1 C182.1 C183.1 C184.1 C185.1 C186.1 C187.1 C188.1 C189.1 C190.1 C191.1 C192.1 C193.1 C194.1 C195.1 C196.1 C197.1 C198.1 C199.1 R65.2
VCC1V5: FB2.1
DDR3_A0: R57.1
DDR3_A1: R56.1
DDR3_A2: R55.1
DDR3_A3: R54.1
DDR3_A4: R53.1
DDR3_A5: R52.1
DDR3_A6: R51.1
DDR3_A7: R50.1
DDR3_A8: R49.1
DDR3_A9: R48.1
DDR3_A10: R47.1
DDR3_A11: R46.1
DDR3_A12: R45.1
DDR3_A13: R44.1
DDR3_A14: R43.1
DDR3_BA0: R42.1
DDR3_BA1: R41.1
DDR3_BA2: R40.1
DDR3_CAS: R61.1 ; port DDR3_Term.DDR3_CAS
DDR3_CKE0: R64.1 ; port DDR3_Term.DDR3_CKE0
DDR3_CLK0_N: R63.2 ; port DDR3_Term.DDR3_CLK0_N
DDR3_CLK0_P: R63.1 ; port DDR3_Term.DDR3_CLK0_P
DDR3_ODT0: R62.1 ; port DDR3_Term.DDR3_ODT0
DDR3_RAS: R60.1 ; port DDR3_Term.DDR3_RAS
DDR3_RESET: R65.1 ; port DDR3_Term.DDR3_RESET
DDR3_S0: R59.1 ; port DDR3_Term.DDR3_S0
DDR3_WE: R58.1 ; port DDR3_Term.DDR3_WE

### Buses and harness runs
bus DDR3_A[0..14]
bus DDR3_BA[0..2]

### Library data of the parts
C162-C193 = CAP_0402: 0.047uF, ceramic, 10% 6.3V X5R, 0402; Part Number: GRM155R60J473KA01D; Manufacturer: Murata Electronics North America; Footprint Ref: CAPC0402(1005)60_N; Library Ref: CAP_0402
C194 C197 = CAP_0603: 4.7uF, ceramic, 10% 6.3V X5R Low ESR, 0603; Part Number: GRM188R60J475KE19D; Manufacturer: Murata Electronics North America; Footprint Ref: CAPC0603(1608)100_N; Library Ref: CAP_0603
C195 C196 C198 C199 = CAP_0402: 0.47uF, ceramic, 10% 6.3V X5R, 0402; Part Number: GRM155R60J474KE19D; Manufacturer: Murata Electronics North America; Footprint Ref: CAPC0402(1005)60_N; Library Ref: CAP_0402
FB2 = FerriteBead0805: MPZ2012S601A, 600 ohm, 100MHz, 0805; Manufacturer: TDK Corporation; Value: 600; Max_Current: *; Part Number: MPZ2012S601A; Footprint Ref: Inductor0805(2012); Library Ref: FerriteBead0805
R40-R62 R64 = RES_0402: 40.2 ohm, 1% 1/16W, 0402; Part Number: RMCF0402FT40R2; Manufacturer: Stackpole Electronics; Library Ref: RES_0402; Footprint Ref: RESC0402(1005)_N
R63 = RES_0402: 80.6 ohm, 1% 1/16W, 0402; Part Number: RMCF0402FT80R6; Manufacturer: Stackpole Electronics; Library Ref: RES_0402; Footprint Ref: RESC0402(1005)_N
R65 = RES_0402: 4.7K ohm, 5%, 1/16W, 0402; Part Number: RC0402JR-074K7L; Manufacturer: Yageo America; Library Ref: RES_0402; Footprint Ref: RESC0402(1005)_N

## Sheet Mounting_Holes.SchDoc
size A4
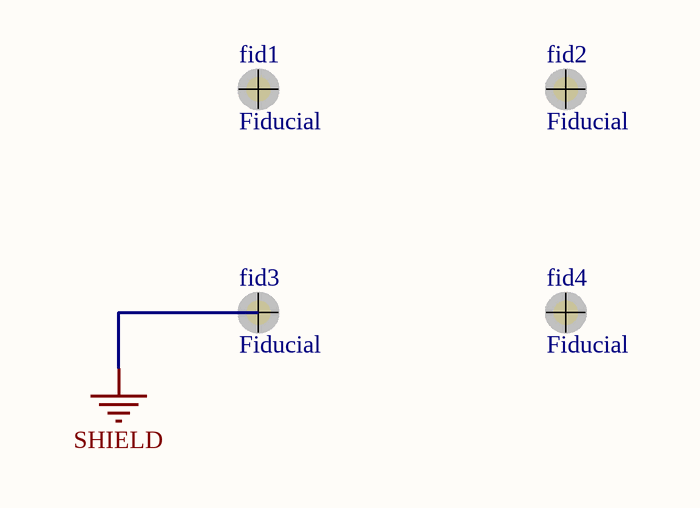
[diagram p46: Mounting_Holes.SchDoc]

### Parts
fid1  Fiducial  [MountingHole_PCB]
fid2  Fiducial  [MountingHole_PCB]
fid3  Fiducial  [MountingHole_PCB]
fid4  Fiducial  [MountingHole_PCB]

### Library data of the parts
fid1-fid4 = Mounting_Holes: Part Number: Mounting_Holes

## Nets that join several sheets
A_VCC1V8: ZYNQ_Power (27 pins), Ethernet1_Power (25 pins), Ethernet2_Power (25 pins), USBJTAG_USBUART_4-Channel (8 pins), Power_Regulators_Digital_4 (5 pins)
A_VCC2V5: Ethernet1_Power (C257.2 C260.2 U6.96 U6.101), Ethernet2_Power (C283.2 C286.2 U16.96 U16.101), Power_Regulators_Ether2V5 (C371.2 C373.2 R238.2 U28.1)
DDR_0V75: Power_Regulators_Digital_4 (C364.2 U25.6 U25.9), DDR3_Power_Termination (24 pins)
DDR_1V5: ZYNQ_DDR3_Bank_502 (R270.2), ZYNQ_Power (27 pins), DDR3_1 (17 pins), DDR3_2 (17 pins), DDR3_Power_Termination (39 pins)
DDR_VREF: ZYNQ_Power (C109.2 C110.2 U2.H7 U2.P7), Power_Regulators_Digital_4 (C367.2 C368.2 U25.1), DDR3_1 (C158.1 C159.2 U4.H1 U4.M8), DDR3_2 (C160.1 C161.2 U5.H1 U5.M8)
GND: ZYNQ_DDR3_Bank_502 (R271.1), ZYNQ_MIOBank_500 (13 pins), ZYNQ_MIOBank_501 (6 pins), ZYNQ_PL_Bank_13 (U54.S), ZYNQ_PL_Bank_33 (J9.5), ZYNQ_PL_Bank_34 (LD6.1), ZYNQ_PL_Bank_35 (9 pins), ZYNQ_Power (211 pins), ZYNQ_CONFIG (13 pins), Ethernet1 (22 pins), Ethernet1_MDIO (C202.1 C203.1 C204.1 C205.1), Ethernet1_Power (57 pins), Ethernet2 (22 pins), Ethernet2_MDIO (6 pins), Ethernet2_Power (57 pins), BootFlash_SPI (C157.1 U3.4), GPS_Receiver (20 pins), USBJTAG_USBUART_4-Channel (53 pins), Temperature_Sensors (6 pins), RF_Receive (J7.G U40.2), RF_Transmit (C436.1 J8.G U46.2 U46.6), RF_Transceiver_LM6002D (12 pins), RF_Transceiver_LM6002D_Power (24 pins), RF_Transceiver_LMS6002_PLL_CLK (11 pins), PowerSwitch (7 pins), Power_Regulators_Digital_1 (30 pins), Power_Regulators_Digital_2 (21 pins), Power_Regulators_Digital_3 (21 pins), Power_Regulators_Digital_4 (21 pins), Power_Regulators_Digital_5 (7 pins), Power_Regulators_Ether2V5 (C371.1 C372.1 R239.1 U28.3), Power_Regulators_RF_2 (8 pins), Power_Regulators_RF_3 (5 pins), Power_Regulators_RF_4 (9 pins), Shundown_Mechanism (8 pins), DDR3_1 (23 pins), DDR3_2 (23 pins), DDR3_Power_Termination (39 pins)
SHIELD: Ethernet1_MDIO (6 pins), Ethernet2_MDIO (J3.M1 J3.M2), USBJTAG_USBUART_4-Channel (J6.S1 J6.S2 J6.S3 J6.S4), PowerSwitch (J12.1)
VADJ: ZYNQ_Power (39 pins), RF_Transceiver_LMS6002_PLL_CLK (C431.1 U43.1), Power_Regulators_Digital_2 (5 pins), Power_Regulators_Digital_5 (R230.1)
VCC1V0: ZYNQ_Power (58 pins), Power_Regulators_Digital_3 (5 pins), Power_Regulators_Digital_5 (U26.5)
VCC1V5: ZYNQ_CONFIG (R31.1), Power_Regulators_Digital_3 (C343.2 C344.2 R211.2), Power_Regulators_Digital_4 (R225.1), Power_Regulators_Digital_5 (R234.1), DDR3_Power_Termination (FB2.1)
VCC3V3: ZYNQ_MIOBank_500 (8 pins), ZYNQ_MIOBank_501 (5 pins), ZYNQ_PL_Bank_13 (R194.2), ZYNQ_PL_Bank_33 (J9.6), ZYNQ_Power (60 pins), ZYNQ_CONFIG (8 pins), Ethernet1 (13 pins), Ethernet1_MDIO (18 pins), Ethernet1_Power (19 pins), Ethernet2 (13 pins), Ethernet2_MDIO (12 pins), Ethernet2_Power (19 pins), BootFlash_SPI (C157.2 U3.8), GPS_Receiver (C288.1 U18.8), USBJTAG_USBUART_4-Channel (40 pins), Temperature_Sensors (6 pins), RF_Transceiver_LMS6002_PLL_CLK (C426.2 U42.1 U42.3), Power_Regulators_Digital_2 (C326.2 C327.2 R202.2), Power_Regulators_Digital_4 (5 pins), Power_Regulators_Digital_5 (R229.2 R233.1 R236.2), Power_Regulators_Ether2V5 (C372.2 U28.5 U28.6), Power_Regulators_RF_2 (R249.2 R250.2)
VCC5V0: Power_Regulators_Digital_1 (9 pins), Power_Regulators_Digital_2 (12 pins), Power_Regulators_Digital_3 (12 pins), Power_Regulators_Digital_4 (5 pins), Power_Regulators_Digital_5 (6 pins)
VCC_1V8_LM: RF_Transceiver_LM6002D_Power (5 pins), Power_Regulators_RF_4 (C386.2 U36.1 U36.2)
VCC_1V8_RXLO_LM: RF_Transceiver_LM6002D_Power (FB20.1), Power_Regulators_RF_4 (C390.2 U38.1 U38.2)
VCC_1V8_TXLO_LM: RF_Transceiver_LM6002D_Power (FB18.2), Power_Regulators_RF_4 (C388.2 U37.1 U37.2)
VCC_3V3_LM: GPS_Receiver (11 pins), RF_Transmit (C436.2 L14.2 L15.2), RF_Transceiver_LM6002D (R5.2 R6.2), RF_Transceiver_LM6002D_Power (17 pins), Power_Regulators_RF_3 (C384.1 L13.2 U35.7), Power_Regulators_RF_4 (12 pins)
VCC_6V0_SG: ZYNQ_PL_Bank_35 (J10.7 J10.8), Power_Regulators_RF_2 (5 pins), Power_Regulators_RF_3 (C383.1 D27.2 U35.2)
VU_12V0: PowerSwitch (SW2.2), Power_Regulators_Digital_1 (16 pins), Power_Regulators_RF_2 (C379.1 U32.2), Shundown_Mechanism (R310.2 R311.2)
Activity_LED_Eth1: Ethernet1 (R78.2 U6.7), Ethernet1_MDIO (R119.2)
Activity_LED_Eth2: Ethernet2 (R157.2 U16.7), Ethernet2_MDIO (R121.2)
CLK_OUT: ZYNQ_PL_Bank_33 (U2.W16), GPS_Receiver (U18.9)
DATA_EN: ZYNQ_PL_Bank_33 (U2.U16), GPS_Receiver (U18.23)
DDR3_A0: ZYNQ_DDR3_Bank_502 (U2.M4), DDR3_1 (U4.N3), DDR3_2 (U5.N3), DDR3_Power_Termination (R57.1)
DDR3_A1: ZYNQ_DDR3_Bank_502 (U2.M5), DDR3_1 (U4.P7), DDR3_2 (U5.P7), DDR3_Power_Termination (R56.1)
DDR3_A2: ZYNQ_DDR3_Bank_502 (U2.K4), DDR3_1 (U4.P3), DDR3_2 (U5.P3), DDR3_Power_Termination (R55.1)
DDR3_A3: ZYNQ_DDR3_Bank_502 (U2.L4), DDR3_1 (U4.N2), DDR3_2 (U5.N2), DDR3_Power_Termination (R54.1)
DDR3_A4: ZYNQ_DDR3_Bank_502 (U2.K6), DDR3_1 (U4.P8), DDR3_2 (U5.P8), DDR3_Power_Termination (R53.1)
DDR3_A5: ZYNQ_DDR3_Bank_502 (U2.K5), DDR3_1 (U4.P2), DDR3_2 (U5.P2), DDR3_Power_Termination (R52.1)
DDR3_A6: ZYNQ_DDR3_Bank_502 (U2.J7), DDR3_1 (U4.R8), DDR3_2 (U5.R8), DDR3_Power_Termination (R51.1)
DDR3_A7: ZYNQ_DDR3_Bank_502 (U2.J6), DDR3_1 (U4.R2), DDR3_2 (U5.R2), DDR3_Power_Termination (R50.1)
DDR3_A8: ZYNQ_DDR3_Bank_502 (U2.J5), DDR3_1 (U4.T8), DDR3_2 (U5.T8), DDR3_Power_Termination (R49.1)
DDR3_A9: ZYNQ_DDR3_Bank_502 (U2.H5), DDR3_1 (U4.R3), DDR3_2 (U5.R3), DDR3_Power_Termination (R48.1)
DDR3_A10: ZYNQ_DDR3_Bank_502 (U2.J3), DDR3_1 (U4.L7), DDR3_2 (U5.L7), DDR3_Power_Termination (R47.1)
DDR3_A11: ZYNQ_DDR3_Bank_502 (U2.G5), DDR3_1 (U4.R7), DDR3_2 (U5.R7), DDR3_Power_Termination (R46.1)
DDR3_A12: ZYNQ_DDR3_Bank_502 (U2.H4), DDR3_1 (U4.N7), DDR3_2 (U5.N7), DDR3_Power_Termination (R45.1)
DDR3_A13: ZYNQ_DDR3_Bank_502 (U2.F4), DDR3_1 (U4.T3), DDR3_2 (U5.T3), DDR3_Power_Termination (R44.1)
DDR3_A14: ZYNQ_DDR3_Bank_502 (U2.G4), DDR3_1 (U4.T7), DDR3_2 (U5.T7), DDR3_Power_Termination (R43.1)
DDR3_BA0: ZYNQ_DDR3_Bank_502 (U2.L7), DDR3_1 (U4.M2), DDR3_2 (U5.M2), DDR3_Power_Termination (R42.1)
DDR3_BA1: ZYNQ_DDR3_Bank_502 (U2.L6), DDR3_1 (U4.N8), DDR3_2 (U5.N8), DDR3_Power_Termination (R41.1)
DDR3_BA2: ZYNQ_DDR3_Bank_502 (U2.M6), DDR3_1 (U4.M3), DDR3_2 (U5.M3), DDR3_Power_Termination (R40.1)
DDR3_CAS: ZYNQ_DDR3_Bank_502 (U2.P3), DDR3_1 (U4.K3), DDR3_2 (U5.K3), DDR3_Power_Termination (R61.1)
DDR3_CKE0: ZYNQ_DDR3_Bank_502 (U2.V3), DDR3_1 (U4.K9), DDR3_2 (U5.K9), DDR3_Power_Termination (R64.1)
DDR3_CLK0_N: ZYNQ_DDR3_Bank_502 (U2.N5), DDR3_1 (U4.K7), DDR3_2 (U5.K7), DDR3_Power_Termination (R63.2)
DDR3_CLK0_P: ZYNQ_DDR3_Bank_502 (U2.N4), DDR3_1 (U4.J7), DDR3_2 (U5.J7), DDR3_Power_Termination (R63.1)
DDR3_DM0: ZYNQ_DDR3_Bank_502 (U2.B1), DDR3_1 (U4.E7)
DDR3_DM1: ZYNQ_DDR3_Bank_502 (U2.H3), DDR3_1 (U4.D3)
DDR3_DM2: ZYNQ_DDR3_Bank_502 (U2.P1), DDR3_2 (U5.E7)
DDR3_DM3: ZYNQ_DDR3_Bank_502 (U2.AA2), DDR3_2 (U5.D3)
DDR3_DQ00: ZYNQ_DDR3_Bank_502 (U2.D1), DDR3_1 (U4.E3)
DDR3_DQ01: ZYNQ_DDR3_Bank_502 (U2.C3), DDR3_1 (U4.F7)
DDR3_DQ02: ZYNQ_DDR3_Bank_502 (U2.B2), DDR3_1 (U4.F2)
DDR3_DQ03: ZYNQ_DDR3_Bank_502 (U2.D3), DDR3_1 (U4.F8)
DDR3_DQ04: ZYNQ_DDR3_Bank_502 (U2.E3), DDR3_1 (U4.H3)
DDR3_DQ05: ZYNQ_DDR3_Bank_502 (U2.E1), DDR3_1 (U4.H8)
DDR3_DQ06: ZYNQ_DDR3_Bank_502 (U2.F2), DDR3_1 (U4.G2)
DDR3_DQ07: ZYNQ_DDR3_Bank_502 (U2.F1), DDR3_1 (U4.H7)
DDR3_DQ08: ZYNQ_DDR3_Bank_502 (U2.G2), DDR3_1 (U4.D7)
DDR3_DQ09: ZYNQ_DDR3_Bank_502 (U2.G1), DDR3_1 (U4.C3)
DDR3_DQ10: ZYNQ_DDR3_Bank_502 (U2.L1), DDR3_1 (U4.C8)
DDR3_DQ11: ZYNQ_DDR3_Bank_502 (U2.L2), DDR3_1 (U4.C2)
DDR3_DQ12: ZYNQ_DDR3_Bank_502 (U2.L3), DDR3_1 (U4.A7)
DDR3_DQ13: ZYNQ_DDR3_Bank_502 (U2.K1), DDR3_1 (U4.A2)
DDR3_DQ14: ZYNQ_DDR3_Bank_502 (U2.J1), DDR3_1 (U4.B8)
DDR3_DQ15: ZYNQ_DDR3_Bank_502 (U2.K3), DDR3_1 (U4.A3)
DDR3_DQ16: ZYNQ_DDR3_Bank_502 (U2.M1), DDR3_2 (U5.E3)
DDR3_DQ17: ZYNQ_DDR3_Bank_502 (U2.T3), DDR3_2 (U5.F7)
DDR3_DQ18: ZYNQ_DDR3_Bank_502 (U2.N3), DDR3_2 (U5.F2)
DDR3_DQ19: ZYNQ_DDR3_Bank_502 (U2.T1), DDR3_2 (U5.F8)
DDR3_DQ20: ZYNQ_DDR3_Bank_502 (U2.R3), DDR3_2 (U5.H3)
DDR3_DQ21: ZYNQ_DDR3_Bank_502 (U2.T2), DDR3_2 (U5.H8)
DDR3_DQ22: ZYNQ_DDR3_Bank_502 (U2.M2), DDR3_2 (U5.G2)
DDR3_DQ23: ZYNQ_DDR3_Bank_502 (U2.R1), DDR3_2 (U5.H7)
DDR3_DQ24: ZYNQ_DDR3_Bank_502 (U2.AA3), DDR3_2 (U5.D7)
DDR3_DQ25: ZYNQ_DDR3_Bank_502 (U2.U1), DDR3_2 (U5.C3)
DDR3_DQ26: ZYNQ_DDR3_Bank_502 (U2.AA1), DDR3_2 (U5.C8)
DDR3_DQ27: ZYNQ_DDR3_Bank_502 (U2.U2), DDR3_2 (U5.C2)
DDR3_DQ28: ZYNQ_DDR3_Bank_502 (U2.W1), DDR3_2 (U5.A7)
DDR3_DQ29: ZYNQ_DDR3_Bank_502 (U2.Y3), DDR3_2 (U5.A2)
DDR3_DQ30: ZYNQ_DDR3_Bank_502 (U2.W3), DDR3_2 (U5.B8)
DDR3_DQ31: ZYNQ_DDR3_Bank_502 (U2.Y1), DDR3_2 (U5.A3)
DDR3_DQS0_N: ZYNQ_DDR3_Bank_502 (U2.D2), DDR3_1 (U4.G3)
DDR3_DQS0_P: ZYNQ_DDR3_Bank_502 (U2.C2), DDR3_1 (U4.F3)
DDR3_DQS1_N: ZYNQ_DDR3_Bank_502 (U2.J2), DDR3_1 (U4.B7)
DDR3_DQS1_P: ZYNQ_DDR3_Bank_502 (U2.H2), DDR3_1 (U4.C7)
DDR3_DQS2_N: ZYNQ_DDR3_Bank_502 (U2.P2), DDR3_2 (U5.G3)
DDR3_DQS2_P: ZYNQ_DDR3_Bank_502 (U2.N2), DDR3_2 (U5.F3)
DDR3_DQS3_N: ZYNQ_DDR3_Bank_502 (U2.W2), DDR3_2 (U5.B7)
DDR3_DQS3_P: ZYNQ_DDR3_Bank_502 (U2.V2), DDR3_2 (U5.C7)
DDR3_ODT0: ZYNQ_DDR3_Bank_502 (U2.P5), DDR3_1 (U4.K1), DDR3_2 (U5.K1), DDR3_Power_Termination (R62.1)
DDR3_RAS: ZYNQ_DDR3_Bank_502 (U2.R5), DDR3_1 (U4.J3), DDR3_2 (U5.J3), DDR3_Power_Termination (R60.1)
DDR3_RESET: ZYNQ_DDR3_Bank_502 (U2.F3), DDR3_1 (U4.T2), DDR3_2 (U5.T2), DDR3_Power_Termination (R65.1)
DDR3_S0: ZYNQ_DDR3_Bank_502 (U2.P6), DDR3_1 (U4.L2), DDR3_2 (U5.L2), DDR3_Power_Termination (R59.1)
DDR3_WE: ZYNQ_DDR3_Bank_502 (U2.R4), DDR3_1 (U4.L3), DDR3_2 (U5.L3), DDR3_Power_Termination (R58.1)
ETH1_RXCLK: ZYNQ_MIOBank_501 (U2.A14), Ethernet1 (R93.1)
ETH1_RXCTL: ZYNQ_MIOBank_501 (U2.D7), Ethernet1 (R92.1)
ETH1_RXD0: ZYNQ_MIOBank_501 (U2.E11), Ethernet1 (R95.1)
ETH1_RXD1: ZYNQ_MIOBank_501 (U2.B7), Ethernet1 (R96.1)
ETH1_RXD2: ZYNQ_MIOBank_501 (U2.F12), Ethernet1 (R97.1)
ETH1_RXD3: ZYNQ_MIOBank_501 (U2.A13), Ethernet1 (R98.1)
ETH1_TXCLK: ZYNQ_MIOBank_501 (U2.D6), Ethernet1 (R70.1)
ETH1_TXCTL: ZYNQ_MIOBank_501 (U2.F11), Ethernet1 (R71.1)
ETH1_TXD0: ZYNQ_MIOBank_501 (U2.E9), Ethernet1 (R73.1)
ETH1_TXD1: ZYNQ_MIOBank_501 (U2.A7), Ethernet1 (R74.1)
ETH1_TXD2: ZYNQ_MIOBank_501 (U2.E10), Ethernet1 (R76.1)
ETH1_TXD3: ZYNQ_MIOBank_501 (U2.A8), Ethernet1 (R77.1)
ETH2_MDIA_N: Ethernet2 (U16.109), Ethernet2_MDIO (J3.10 R187.1)
ETH2_MDIA_P: Ethernet2 (U16.108), Ethernet2_MDIO (J3.11 R183.1)
ETH2_MDIB_N: Ethernet2 (U16.115), Ethernet2_MDIO (J3.5 R186.1)
ETH2_MDIB_P: Ethernet2 (U16.114), Ethernet2_MDIO (J3.4 R182.1)
ETH2_MDIC_N: Ethernet2 (U16.121), Ethernet2_MDIO (J3.2 R185.1)
ETH2_MDIC_P: Ethernet2 (U16.120), Ethernet2_MDIO (J3.3 R181.1)
ETH2_MDID_N: Ethernet2 (U16.127), Ethernet2_MDIO (J3.9 R184.1)
ETH2_MDID_P: Ethernet2 (U16.126), Ethernet2_MDIO (J3.8 R180.1)
ETH2_RXCLK: ZYNQ_MIOBank_501 (U2.B12), Ethernet2 (R172.1)
ETH2_RXCTL: ZYNQ_MIOBank_501 (U2.C13), Ethernet2 (R171.1)
ETH2_RXD0: ZYNQ_MIOBank_501 (U2.F14), Ethernet2 (R174.1)
ETH2_RXD1: ZYNQ_MIOBank_501 (U2.A9), Ethernet2 (R175.1)
ETH2_RXD2: ZYNQ_MIOBank_501 (U2.B14), Ethernet2 (R176.1)
ETH2_RXD3: ZYNQ_MIOBank_501 (U2.F13), Ethernet2 (R177.1)
ETH2_TXCLK: ZYNQ_MIOBank_501 (U2.A12), Ethernet2 (R149.1)
ETH2_TXCTL: ZYNQ_MIOBank_501 (U2.G13), Ethernet2 (R150.1)
ETH2_TXD0: ZYNQ_MIOBank_501 (U2.E8), Ethernet2 (R152.1)
ETH2_TXD1: ZYNQ_MIOBank_501 (U2.A11), Ethernet2 (R153.1)
ETH2_TXD2: ZYNQ_MIOBank_501 (U2.F9), Ethernet2 (R155.1)
ETH2_TXD3: ZYNQ_MIOBank_501 (U2.C7), Ethernet2 (R156.1)
I2C_EN: ZYNQ_PL_Bank_13 (U2.Y10), USBJTAG_USBUART_4-Channel (R291.2 R301.2 U52.5)
JTAG_HEAD_PROG_RST: ZYNQ_CONFIG (J1.7), USBJTAG_USBUART_4-Channel (R305.1 U53.3)
JTAG_TCLK: ZYNQ_CONFIG (R33.2 U2.G11), USBJTAG_USBUART_4-Channel (R284.1 U49.3)
JTAG_TDI: ZYNQ_CONFIG (R35.2 U2.H13), USBJTAG_USBUART_4-Channel (R288.1 U49.6)
JTAG_TDO: ZYNQ_CONFIG (R37.2 U2.G14), USBJTAG_USBUART_4-Channel (R298.1 U49.12)
JTAG_TMS: ZYNQ_CONFIG (R36.2 U2.G12), USBJTAG_USBUART_4-Channel (R293.1 U49.8)
Link1000_LED_Eth1: Ethernet1 (R81.2 U6.10), Ethernet1_MDIO (R118.2)
Link1000_LED_Eth2: Ethernet2 (R160.2 U16.10), Ethernet2_MDIO (R120.2)
LM_RESET: ZYNQ_PL_Bank_35 (U2.G16), RF_Transceiver_LM6002D (R21.1)
MAG: ZYNQ_PL_Bank_33 (U2.U15), GPS_Receiver (U18.11)
MDC: ZYNQ_MIOBank_501 (U2.D10), Ethernet1 (U6.81), Ethernet2 (U16.81)
MDIA_N: Ethernet1 (U6.109), Ethernet1_MDIO (R108.1 U8.3)
MDIA_P: Ethernet1 (U6.108), Ethernet1_MDIO (R104.1 U8.2)
MDIB_N: Ethernet1 (U6.115), Ethernet1_MDIO (R107.1 U8.6)
MDIB_P: Ethernet1 (U6.114), Ethernet1_MDIO (R103.1 U8.5)
MDIC_N: Ethernet1 (U6.121), Ethernet1_MDIO (R106.1 U8.9)
MDIC_P: Ethernet1 (U6.120), Ethernet1_MDIO (R102.1 U8.8)
MDID_N: Ethernet1 (U6.127), Ethernet1_MDIO (R105.1 U8.12)
MDID_P: Ethernet1 (U6.126), Ethernet1_MDIO (R101.1 U8.11)
MDIO: ZYNQ_MIOBank_501 (U2.C12), Ethernet1 (R68.1 U6.80), Ethernet2 (R147.1 U16.80)
NetJ10_5: ZYNQ_PL_Bank_13 (U2.Y11), ZYNQ_PL_Bank_35 (J10.5), USBJTAG_USBUART_4-Channel (U52.6), Temperature_Sensors (U56.B1 U57.B1 U58.B1)
NetJ10_6: ZYNQ_PL_Bank_13 (U2.AA8), ZYNQ_PL_Bank_35 (J10.6), USBJTAG_USBUART_4-Channel (U52.7), Temperature_Sensors (U56.B2 U57.B2 U58.B2)
NetJ11_2: ZYNQ_PL_Bank_13 (U54.G), Ethernet1_MDIO (J11.2)
NetR195_2: Power_Regulators_Digital_1 (R195.2 U20.4), Power_Regulators_RF_2 (R250.1 U32.5 U34.D), Shundown_Mechanism (R314.1 U62.D)
NetR316_2: ZYNQ_MIOBank_500 (U2.G6), Shundown_Mechanism (R316.2 U63.1)
PGOOD_ALL: Power_Regulators_Digital_5 (6 pins), Power_Regulators_RF_2 (U33.G)
PGOOD_DDR: Power_Regulators_Digital_4 (U25.5), Power_Regulators_Digital_5 (5 pins)
PGOOD_VCC1V0: Power_Regulators_Digital_4 (U24.B3), Power_Regulators_Digital_5 (C369.2 D20.2 R231.1 U26.2)
PGOOD_VCC1V8: Power_Regulators_Digital_2 (U22.10 U22.25), Power_Regulators_Digital_3 (U23.10), Power_Regulators_Digital_4 (C359.2 D19.2 R220.1 U24.C3)
PGOOD_VCC5V0: Power_Regulators_Digital_1 (R199.1 U20.32), Power_Regulators_Digital_3 (U23.25)
PLL_CLK: RF_Transceiver_LM6002D (U1.71), RF_Transceiver_LMS6002_PLL_CLK (R266.1)
PLL_CLK_OUT: ZYNQ_PL_Bank_35 (U2.C17), RF_Transceiver_LM6002D (R4.1)
PS_MODE0/SPI_DQ0: ZYNQ_MIOBank_500 (R279.1 U2.A2), BootFlash_SPI (U3.5)
PS_MODE1/SPI_DQ1: ZYNQ_MIOBank_500 (R274.1 U2.F6), BootFlash_SPI (U3.2)
PS_MODE2/SPI_DQ2: ZYNQ_MIOBank_500 (R275.1 U2.E4), BootFlash_SPI (U3.3)
PS_MODE3/SPI_DQ3: ZYNQ_MIOBank_500 (R277.1 U2.A3), BootFlash_SPI (U3.7)
PS_MODE4/SPI_SCLK: ZYNQ_MIOBank_500 (R272.2 R278.1), BootFlash_SPI (U3.6)
PS_POR_B: ZYNQ_MIOBank_500 (U2.B5), Ethernet1 (R66.2 U6.33), Ethernet2 (R145.2 U16.33), Power_Regulators_Digital_5 (R229.1 U26.14)
PS_SRST_B: ZYNQ_MIOBank_501 (R281.1 SW3.3 U2.C9), USBJTAG_USBUART_4-Channel (U53.4 U53.6)
RX_CLK: ZYNQ_PL_Bank_34 (U2.N19), RF_Transceiver_LM6002D (R7.1)
RX_CLKOUT: ZYNQ_PL_Bank_34 (U2.L19), RF_Transceiver_LM6002D (R26.1)
RX_EN: ZYNQ_PL_Bank_34 (U2.T19), RF_Transceiver_LM6002D (R11.1)
RX_IQ_SEL: ZYNQ_PL_Bank_34 (U2.T16), RF_Transceiver_LM6002D (R9.1)
RXD.0: ZYNQ_PL_Bank_34 (U2.P22), RF_Transceiver_LM6002D (R13.8)
RXD.1: ZYNQ_PL_Bank_34 (U2.N22), RF_Transceiver_LM6002D (R13.7)
RXD.2: ZYNQ_PL_Bank_34 (U2.R21), RF_Transceiver_LM6002D (R13.6)
RXD.3: ZYNQ_PL_Bank_34 (U2.R20), RF_Transceiver_LM6002D (R13.5)
RXD.4: ZYNQ_PL_Bank_34 (U2.P21), RF_Transceiver_LM6002D (R15.8)
RXD.5: ZYNQ_PL_Bank_34 (U2.P20), RF_Transceiver_LM6002D (R15.7)
RXD.6: ZYNQ_PL_Bank_34 (U2.N15), RF_Transceiver_LM6002D (R15.6)
RXD.7: ZYNQ_PL_Bank_34 (U2.K15), RF_Transceiver_LM6002D (R15.5)
RXD.8: ZYNQ_PL_Bank_34 (U2.J15), RF_Transceiver_LM6002D (R17.8)
RXD.9: ZYNQ_PL_Bank_34 (U2.P18), RF_Transceiver_LM6002D (R17.7)
RXD.10: ZYNQ_PL_Bank_34 (U2.P17), RF_Transceiver_LM6002D (R17.6)
RXD.11: ZYNQ_PL_Bank_34 (U2.T17), RF_Transceiver_LM6002D (R17.5)
RXIN1_N: RF_Receive (C397.1), RF_Transceiver_LM6002D (U1.98)
RXIN1_P: RF_Receive (C399.1), RF_Transceiver_LM6002D (U1.96)
SCLK: ZYNQ_MIOBank_500 (U2.C5), RF_Transceiver_LM6002D (R22.1)
SDIO: ZYNQ_MIOBank_500 (U2.G7), RF_Transceiver_LM6002D (R24.1)
SDO: ZYNQ_MIOBank_500 (U2.B4), RF_Transceiver_LM6002D (R25.1)
SEN: ZYNQ_MIOBank_500 (U2.A6), RF_Transceiver_LM6002D (R23.1)
SIGN: ZYNQ_PL_Bank_33 (U2.V17), GPS_Receiver (U18.10)
SPI_CS: ZYNQ_MIOBank_500 (U2.A1), BootFlash_SPI (U3.1)
TX_CLK: ZYNQ_PL_Bank_35 (U2.D20), RF_Transceiver_LM6002D (R8.2)
TX_EN: ZYNQ_PL_Bank_35 (U2.G21), RF_Transceiver_LM6002D (R12.2)
TX_IQ_SEL: ZYNQ_PL_Bank_35 (U2.E19), RF_Transceiver_LM6002D (R10.2)
TXD00: ZYNQ_PL_Bank_35 (U2.C22), RF_Transceiver_LM6002D (R14.1)
TXD01: ZYNQ_PL_Bank_35 (U2.D22), RF_Transceiver_LM6002D (R14.2)
TXD02: ZYNQ_PL_Bank_35 (U2.D21), RF_Transceiver_LM6002D (R14.3)
TXD03: ZYNQ_PL_Bank_35 (U2.E21), RF_Transceiver_LM6002D (R14.4)
TXD04: ZYNQ_PL_Bank_35 (U2.B22), RF_Transceiver_LM6002D (R16.1)
TXD05: ZYNQ_PL_Bank_35 (U2.B21), RF_Transceiver_LM6002D (R16.2)
TXD06: ZYNQ_PL_Bank_35 (U2.H19), RF_Transceiver_LM6002D (R16.3)
TXD07: ZYNQ_PL_Bank_35 (U2.E16), RF_Transceiver_LM6002D (R16.4)
TXD08: ZYNQ_PL_Bank_35 (U2.F16), RF_Transceiver_LM6002D (R18.1)
TXD09: ZYNQ_PL_Bank_35 (U2.F19), RF_Transceiver_LM6002D (R18.2)
TXD10: ZYNQ_PL_Bank_35 (U2.G19), RF_Transceiver_LM6002D (R18.3)
TXD11: ZYNQ_PL_Bank_35 (U2.E20), RF_Transceiver_LM6002D (R18.4)
TXOUT1_N: RF_Transmit (C437.1 C441.2 L15.1 L17.2), RF_Transceiver_LM6002D (U1.48)
TXOUT1_P: RF_Transmit (C441.1 C442.1 L14.1 L17.1), RF_Transceiver_LM6002D (U1.50)
UART_0_RXD: ZYNQ_MIOBank_501 (U2.D11), USBJTAG_USBUART_4-Channel (U51.39)
UART_0_TXD: ZYNQ_MIOBank_501 (U2.C14), USBJTAG_USBUART_4-Channel (U51.38)
UART_1_RXD: ZYNQ_PL_Bank_13 (U2.AB5), USBJTAG_USBUART_4-Channel (U51.52)
UART_1_TXD: ZYNQ_PL_Bank_13 (U2.AB4), USBJTAG_USBUART_4-Channel (U51.48)